# EAGLE schematic Orbiter_RING_V4_0 (EAGLE 9.0.1)
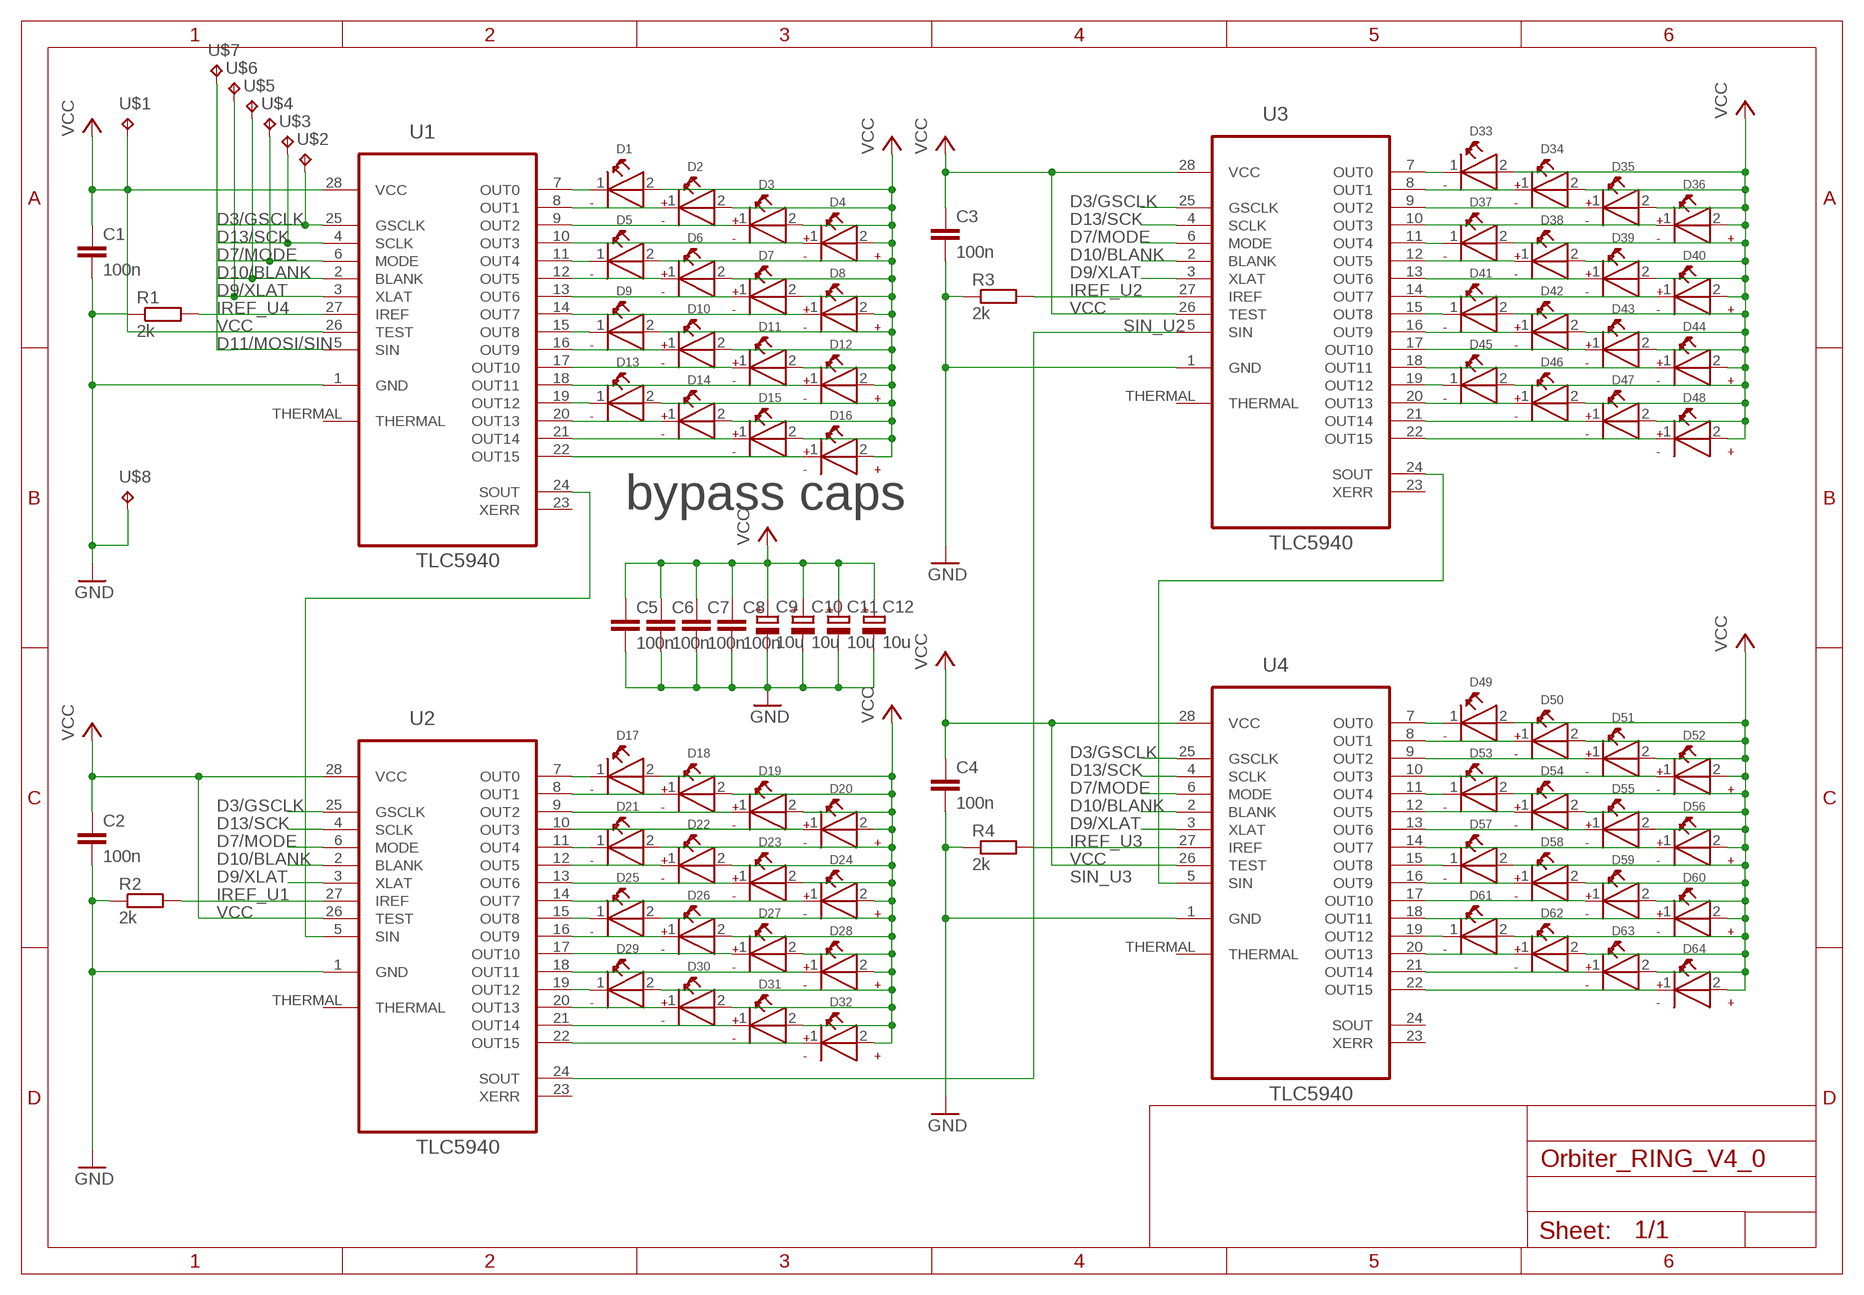
[diagram p0: schematic, sheet 1]

## Parts
C1  100n  CAPACITOR"  [C0603]
C2  100n  CAPACITOR"  [C0603]
C3  100n  CAPACITOR"  [C0603]
C4  100n  CAPACITOR"  [C0603]
C5  100n  CAPACITOR"  [C0603]
C6  100n  CAPACITOR"  [C0603]
C7  100n  CAPACITOR"  [C0603]
C8  100n  CAPACITOR"  [C0603]
C9  10u  SMD_ELCTROLYTIC  [153CLV-0605]
C10  10u  SMD_ELCTROLYTIC  [153CLV-0605]
C11  10u  SMD_ELCTROLYTIC  [153CLV-0605]
C12  10u  SMD_ELCTROLYTIC  [153CLV-0605]
D1  SMD_LED_0603  [WL-SMCW_0603]
D2  SMD_LED_0603  [WL-SMCW_0603]
D3  SMD_LED_0603  [WL-SMCW_0603]
D4  SMD_LED_0603  [WL-SMCW_0603]
D5  SMD_LED_0603  [WL-SMCW_0603]
D6  SMD_LED_0603  [WL-SMCW_0603]
D7  SMD_LED_0603  [WL-SMCW_0603]
D8  SMD_LED_0603  [WL-SMCW_0603]
D9  SMD_LED_0603  [WL-SMCW_0603]
D10  SMD_LED_0603  [WL-SMCW_0603]
D11  SMD_LED_0603  [WL-SMCW_0603]
D12  SMD_LED_0603  [WL-SMCW_0603]
D13  SMD_LED_0603  [WL-SMCW_0603]
D14  SMD_LED_0603  [WL-SMCW_0603]
D15  SMD_LED_0603  [WL-SMCW_0603]
D16  SMD_LED_0603  [WL-SMCW_0603]
D17  SMD_LED_0603  [WL-SMCW_0603]
D18  SMD_LED_0603  [WL-SMCW_0603]
D19  SMD_LED_0603  [WL-SMCW_0603]
D20  SMD_LED_0603  [WL-SMCW_0603]
D21  SMD_LED_0603  [WL-SMCW_0603]
D22  SMD_LED_0603  [WL-SMCW_0603]
D23  SMD_LED_0603  [WL-SMCW_0603]
D24  SMD_LED_0603  [WL-SMCW_0603]
D25  SMD_LED_0603  [WL-SMCW_0603]
D26  SMD_LED_0603  [WL-SMCW_0603]
D27  SMD_LED_0603  [WL-SMCW_0603]
D28  SMD_LED_0603  [WL-SMCW_0603]
D29  SMD_LED_0603  [WL-SMCW_0603]
D30  SMD_LED_0603  [WL-SMCW_0603]
D31  SMD_LED_0603  [WL-SMCW_0603]
D32  SMD_LED_0603  [WL-SMCW_0603]
D33  SMD_LED_0603  [WL-SMCW_0603]
D34  SMD_LED_0603  [WL-SMCW_0603]
D35  SMD_LED_0603  [WL-SMCW_0603]
D36  SMD_LED_0603  [WL-SMCW_0603]
D37  SMD_LED_0603  [WL-SMCW_0603]
D38  SMD_LED_0603  [WL-SMCW_0603]
D39  SMD_LED_0603  [WL-SMCW_0603]
D40  SMD_LED_0603  [WL-SMCW_0603]
D41  SMD_LED_0603  [WL-SMCW_0603]
D42  SMD_LED_0603  [WL-SMCW_0603]
D43  SMD_LED_0603  [WL-SMCW_0603]
D44  SMD_LED_0603  [WL-SMCW_0603]
D45  SMD_LED_0603  [WL-SMCW_0603]
D46  SMD_LED_0603  [WL-SMCW_0603]
D47  SMD_LED_0603  [WL-SMCW_0603]
D48  SMD_LED_0603  [WL-SMCW_0603]
D49  SMD_LED_0603  [WL-SMCW_0603]
D50  SMD_LED_0603  [WL-SMCW_0603]
D51  SMD_LED_0603  [WL-SMCW_0603]
D52  SMD_LED_0603  [WL-SMCW_0603]
D53  SMD_LED_0603  [WL-SMCW_0603]
D54  SMD_LED_0603  [WL-SMCW_0603]
D55  SMD_LED_0603  [WL-SMCW_0603]
D56  SMD_LED_0603  [WL-SMCW_0603]
D57  SMD_LED_0603  [WL-SMCW_0603]
D58  SMD_LED_0603  [WL-SMCW_0603]
D59  SMD_LED_0603  [WL-SMCW_0603]
D60  SMD_LED_0603  [WL-SMCW_0603]
D61  SMD_LED_0603  [WL-SMCW_0603]
D62  SMD_LED_0603  [WL-SMCW_0603]
D63  SMD_LED_0603  [WL-SMCW_0603]
D64  SMD_LED_0603  [WL-SMCW_0603]
R1  2k  RESISTOR"  [R0805]
R2  2k  RESISTOR"  [R0805]
R3  2k  RESISTOR"  [R0805]
R4  2k  RESISTOR"  [R0805]
U1  TLC5940  TLC59401PWP  [SOP65P640X120-29N]
U2  TLC5940  TLC59401PWP  [SOP65P640X120-29N]
U3  TLC5940  TLC59401PWP  [SOP65P640X120-29N]
U4  TLC5940  TLC59401PWP  [SOP65P640X120-29N]
U$1  TP  [OVAL_PAD]
U$2  TP  [OVAL_PAD]
U$3  TP  [OVAL_PAD]
U$4  TP  [OVAL_PAD]
U$5  TP  [OVAL_PAD]
U$6  TP  [OVAL_PAD]
U$7  TP  [OVAL_PAD]
U$8  TP  [OVAL_PAD]

## Nets
D3/GSCLK: U1.25(GSCLK) U2.25(GSCLK) U3.25(GSCLK) U4.25(GSCLK) U$2.P$1(TP)
D7/MODE: U1.6(MODE) U2.6(MODE) U3.6(MODE) U4.6(MODE) U$4.P$1(TP)
D9/XLAT: U1.3(XLAT) U2.3(XLAT) U3.3(XLAT) U4.3(XLAT) U$6.P$1(TP)
D10/BLANK: U1.2(BLANK) U2.2(BLANK) U3.2(BLANK) U4.2(BLANK) U$5.P$1(TP)
D11/MOSI/SIN: U1.5(SIN) U$7.P$1(TP)
D13/SCK: U1.4(SCLK) U2.4(SCLK) U3.4(SCLK) U4.4(SCLK) U$3.P$1(TP)
GND: C1.2 C2.2 C3.2 C4.2 C5.2 C6.2 C7.2 C8.2 C9.- C10.- C11.- C12.- R1.1 R2.1 R3.1 R4.1 U1.1(GND) U2.1(GND) U3.1(GND) U4.1(GND) U$8.P$1(TP)
IREF_U1: R2.2 U2.27(IREF)
IREF_U2: R3.2 U3.27(IREF)
IREF_U3: R4.2 U4.27(IREF)
IREF_U4: R1.2 U1.27(IREF)
N$1: D17.1(-) U2.7(OUT0)
N$2: U1.24(SOUT) U2.5(SIN)
N$3: D18.1(-) U2.8(OUT1)
N$4: D24.1(-) U2.14(OUT7)
N$5: D19.1(-) U2.9(OUT2)
N$6: D25.1(-) U2.15(OUT8)
N$7: D20.1(-) U2.10(OUT3)
N$8: D26.1(-) U2.16(OUT9)
N$9: D21.1(-) U2.11(OUT4)
N$10: D22.1(-) U2.12(OUT5)
N$11: D23.1(-) U2.13(OUT6)
N$12: D27.1(-) U2.17(OUT10)
N$13: D28.1(-) U2.18(OUT11)
N$14: D29.1(-) U2.19(OUT12)
N$15: D30.1(-) U2.20(OUT13)
N$16: D31.1(-) U2.21(OUT14)
N$17: D32.1(-) U2.22(OUT15)
N$19: D33.1(-) U3.7(OUT0)
N$20: D34.1(-) U3.8(OUT1)
N$21: D35.1(-) U3.9(OUT2)
N$22: D36.1(-) U3.10(OUT3)
N$23: D37.1(-) U3.11(OUT4)
N$24: D38.1(-) U3.12(OUT5)
N$25: D39.1(-) U3.13(OUT6)
N$26: D40.1(-) U3.14(OUT7)
N$27: D41.1(-) U3.15(OUT8)
N$28: D42.1(-) U3.16(OUT9)
N$29: D43.1(-) U3.17(OUT10)
N$31: D44.1(-) U3.18(OUT11)
N$32: D45.1(-) U3.19(OUT12)
N$33: D46.1(-) U3.20(OUT13)
N$34: D47.1(-) U3.21(OUT14)
N$35: D48.1(-) U3.22(OUT15)
N$39: D49.1(-) U4.7(OUT0)
N$40: D50.1(-) U4.8(OUT1)
N$41: D51.1(-) U4.9(OUT2)
N$42: D52.1(-) U4.10(OUT3)
N$43: D53.1(-) U4.11(OUT4)
N$44: D54.1(-) U4.12(OUT5)
N$45: D55.1(-) U4.13(OUT6)
N$46: D56.1(-) U4.14(OUT7)
N$47: D57.1(-) U4.15(OUT8)
N$48: D58.1(-) U4.16(OUT9)
N$49: D59.1(-) U4.17(OUT10)
N$50: D60.1(-) U4.18(OUT11)
N$51: D61.1(-) U4.19(OUT12)
N$52: D62.1(-) U4.20(OUT13)
N$53: D63.1(-) U4.21(OUT14)
N$54: D64.1(-) U4.22(OUT15)
N$58: D1.1(-) U1.7(OUT0)
N$59: D2.1(-) U1.8(OUT1)
N$60: D3.1(-) U1.9(OUT2)
N$61: D4.1(-) U1.10(OUT3)
N$62: D5.1(-) U1.11(OUT4)
N$63: D6.1(-) U1.12(OUT5)
N$64: D7.1(-) U1.13(OUT6)
N$65: D8.1(-) U1.14(OUT7)
N$66: D9.1(-) U1.15(OUT8)
N$67: D10.1(-) U1.16(OUT9)
N$68: D11.1(-) U1.17(OUT10)
N$69: D12.1(-) U1.18(OUT11)
N$70: D13.1(-) U1.19(OUT12)
N$71: D14.1(-) U1.20(OUT13)
N$72: D15.1(-) U1.21(OUT14)
N$73: D16.1(-) U1.22(OUT15)
SIN_U2: U2.24(SOUT) U3.5(SIN)
SIN_U3: U3.24(SOUT) U4.5(SIN)
VCC: C1.1 C2.1 C3.1 C4.1 C5.1 C6.1 C7.1 C8.1 C9.+ C10.+ C11.+ C12.+ D1.2(+) D2.2(+) D3.2(+) D4.2(+) D5.2(+) D6.2(+) D7.2(+) D8.2(+) D9.2(+) D10.2(+) D11.2(+) D12.2(+) D13.2(+) D14.2(+) D15.2(+) D16.2(+) D17.2(+) D18.2(+) D19.2(+) D20.2(+) D21.2(+) D22.2(+) D23.2(+) D24.2(+) D25.2(+) D26.2(+) D27.2(+) D28.2(+) D29.2(+) D30.2(+) D31.2(+) D32.2(+) D33.2(+) D34.2(+) D35.2(+) D36.2(+) D37.2(+) D38.2(+) D39.2(+) D40.2(+) D41.2(+) D42.2(+) D43.2(+) D44.2(+) D45.2(+) D46.2(+) D47.2(+) D48.2(+) D49.2(+) D50.2(+) D51.2(+) D52.2(+) D53.2(+) D54.2(+) D55.2(+) D56.2(+) D57.2(+) D58.2(+) D59.2(+) D60.2(+) D61.2(+) D62.2(+) D63.2(+) D64.2(+) U1.26(TEST) U1.28(VCC) U2.26(TEST) U2.28(VCC) U3.26(TEST) U3.28(VCC) U4.26(TEST) U4.28(VCC) U$1.P$1(TP)
Unconnected: U1.23(XERR) U1.THERMAL U2.23(XERR) U2.THERMAL U3.23(XERR) U3.THERMAL U4.23(XERR) U4.24(SOUT) U4.THERMAL

## Notes on the sheet
- bypass caps

## Library data of the parts
C1-C8 = C_Sager_Bibliothek:CAPACITOR: capacitor
C9-C12 = C_Sager_Bibliothek:SMD_ELCTROLYTIC: SMD Elektrolyt Kondensator 153CLV-0605
D1-D64 = C_Sager_Bibliothek:SMD_LED_0603: SMD LED 0603
R1-R4 = C_Sager_Bibliothek:RESISTOR: +/- 5 % resistor
U1-U4 = C_Sager_Bibliothek:TLC59401PWP: 16-CHANNEL LED DRIVER; MPN: TLC59401PWP; OC_FARNELL: -; OC_NEWARK: 64R0661; PACKAGE: TSSOP-28; SUPPLIER: Texas Instruments
U$1-U$8 = C_Sager_Bibliothek:TP